# EAGLE design star (EAGLE 7.7.0)
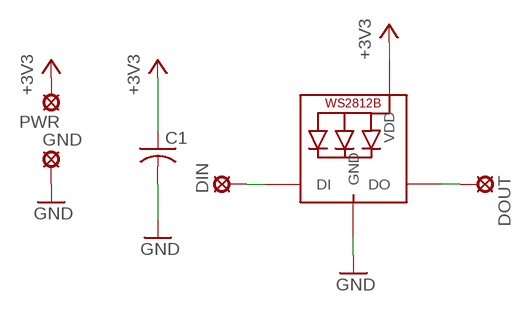
[diagram p0: schematic, sheet 1]

## Parts
C1  C-USC0402K  [C0402K]
DIN  50THOU  [50THOU]
DOUT  50THOU  [50THOU]
GND  50THOU  [50THOU]
LED1  WS2812B5050  [WS2812B]
PWR  50THOU  [50THOU]

## Nets
+3V3: C1.1 LED1.1-VDD(VDD) PWR.P$1(MP)
GND: C1.2 GND.P$1(MP) LED1.3-GND(GND)
N$1: DIN.P$1(MP) LED1.4-DIN(DI)
N$2: DOUT.P$1(MP) LED1.2-DOUT(DO)

## Library data of the parts
C1 = resistor:C-US: CAPACITOR, American symbol
DIN DOUT GND PWR = solpad:50THOU
LED1 = adafruit:WS2812B

## Board
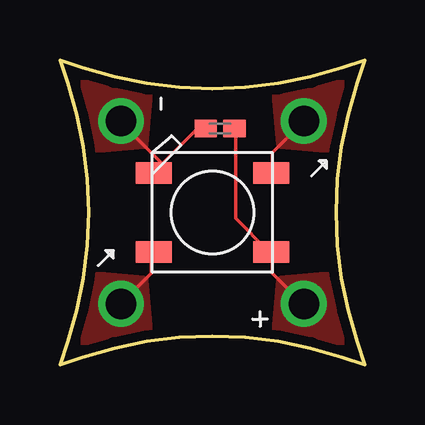
[diagram p1: board, top side]
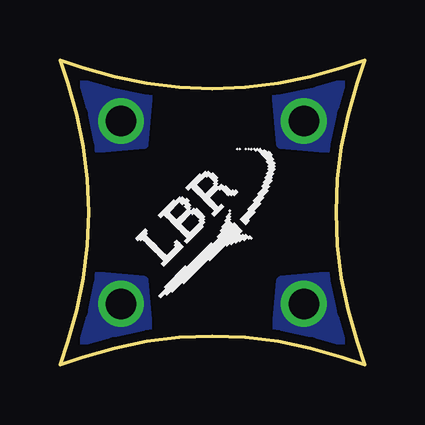
[diagram p2: board, bottom side, seen from below]

Size 12.7 x 12.7 mm. Coordinates in mm from the lower left corner, seen from the top.
Outline: 0.95,0.32 0,0 0.32,0.95
Outline: 0.95,0.32 arc-37 11.75,0.32
Outline: 11.75,0.32 12.7,0 12.38,0.95
Outline: 0.95,0.32 arc-37 11.75,0.32
Outline: 12.38,0.95 arc-37 12.38,11.75
Outline: 12.38,11.75 12.7,12.7 11.75,12.38
Outline: 12.38,0.95 arc-37 12.38,11.75
Outline: 11.75,12.38 arc-37 0.95,12.38
Outline: 0.95,12.38 0,12.7 0.32,11.75
Outline: 11.75,12.38 arc-37 0.95,12.38
Outline: 0.32,11.75 arc-37 0.32,0.95
Outline: 0.32,11.75 arc-37 0.32,0.95
Copper layers (1*16): Top 0.0356mm / dielectric 1.5011mm / Bottom 0.0356mm
Design rules "LaenPCBOrder *": minimum track width 6mil, minimum drill 13mil, track to track 6mil, track to pad 6mil, pad to pad 6mil, via to via 6mil, smd to smd 0mil, copper to edge 15mil, drill to drill 6mil, minimum pad ring 7mil, minimum via ring 7mil, stop-mask expansion 3mil, vias tented up to drill 0mil, thermal gap 10mil

### Footprints (pad centres in the part's own frame; a part is rotated, then mirrored left to right if it is on the bottom)
C0402K = smd 0.925 x 0.74: 1 -0.6,0; 2 0.6,0
50THOU = drill 1.27: P$1 0,0
WS2812B = smd 1.5 x 0.9: 1-VDD 2.45,-1.65; 2-DOUT 2.45,1.65; 3-GND -2.45,1.65; 4-DIN -2.45,-1.65

### Placement (x,y rotation side)
C1  6.67,9.84 180 top
DIN  2.54,2.54 0 top
DOUT  10.16,10.16 0 top
GND  2.54,10.16 0 top
LED1  6.35,6.35 0 top
PWR  10.16,2.54 0 top
U$1  [LOGO-0.30"]  7.78,1.98 45 bottom

### Tracks (layer width: path | path; a pad name or v marks a point on that pad's centre or on a via)
+3V3
  Top 0.152: C1.1 7.32,9.75 7.32,6.1 8.69,4.72 LED1.1-VDD 8.84,4.57 8.84,3.81 10.36,2.29 PWR.P$1
  pour Top (no thermals): 12.7,0 12.7,3.81 9.21,3.49 8.89,0
  pour Bottom (no thermals): 12.7,0 8.89,0 9.21,3.49 12.7,3.81
GND
  Top 0.152: 4.27,8.38 3.96,8.08 LED1.3-GND 4.27,8.38 | 4.27,8.38 5.64,9.75 5.94,9.75 C1.2 | 4.27,8.38 2.29,10.36 GND.P$1
  pour Top (no thermals): 0,12.7 0,8.89 3.49,9.21 3.81,12.7
  pour Bottom (no thermals): 0,12.7 3.81,12.7 3.49,9.21 0,8.89
N$1
  Top 0.152: DIN.P$1 3.81,3.81 3.81,4.57 LED1.4-DIN
  pour Top (no thermals): 0,0 3.81,0 3.49,3.49 0,3.81
  pour Bottom (no thermals): 0,0 0,3.81 3.49,3.49 3.81,0
N$2
  Top 0.152: DOUT.P$1 8.84,8.84 8.84,8.08 LED1.2-DOUT
  pour Top (no thermals): 12.7,12.7 8.89,12.7 9.21,9.21 12.7,8.89
  pour Bottom (no thermals): 12.7,12.7 12.7,8.89 9.21,9.21 8.89,12.7